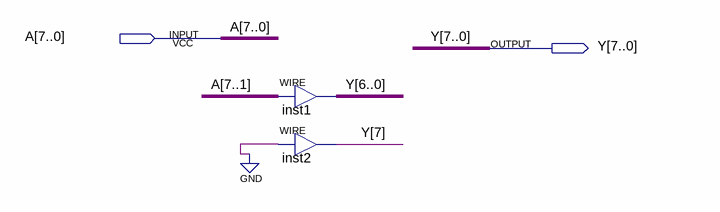
[diagram p0: schematic sheet]
// Quartus schematic 1BitRigthShift.bdf as structural Verilog: 2 symbols, 2 pins
module \1BitRigthShift  (
  input  [7:0] A,
  output [7:0] Y
);

  assign Y[6:0] = A[7:1];  // WIRE inst1
  assign Y[7] = 1'b0;  // WIRE inst2
endmodule
